# EAGLE design slouchpad_v1_shoulder (EAGLE 8.0.1)
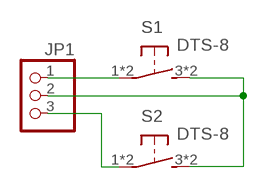
[diagram p0: schematic, sheet 1]

## Parts
JP1  PINHD-1X3  [1X03]
S1  DTS-8  [DTS-8]
S2  DTS-8  [DTS-8]

## Nets
GND: JP1.2 S1.3 S1.4 S2.3 S2.4
S1: JP1.1 S1.1 S1.2
S2: JP1.3 S2.1 S2.2

## Library data of the parts
JP1 = pinhead:PINHD-1X3: PIN HEADER
S1 S2 = switch-tact:DTS-8

## Board
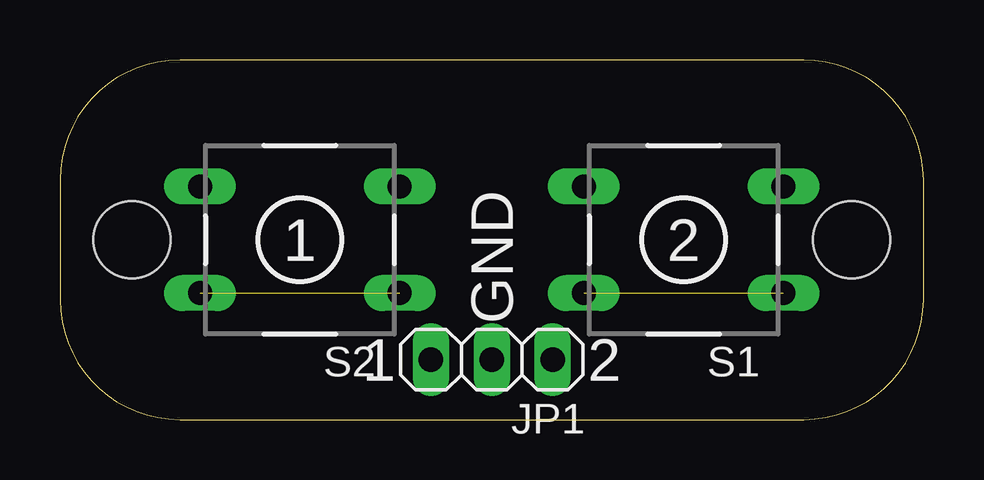
[diagram p1: board, top side]
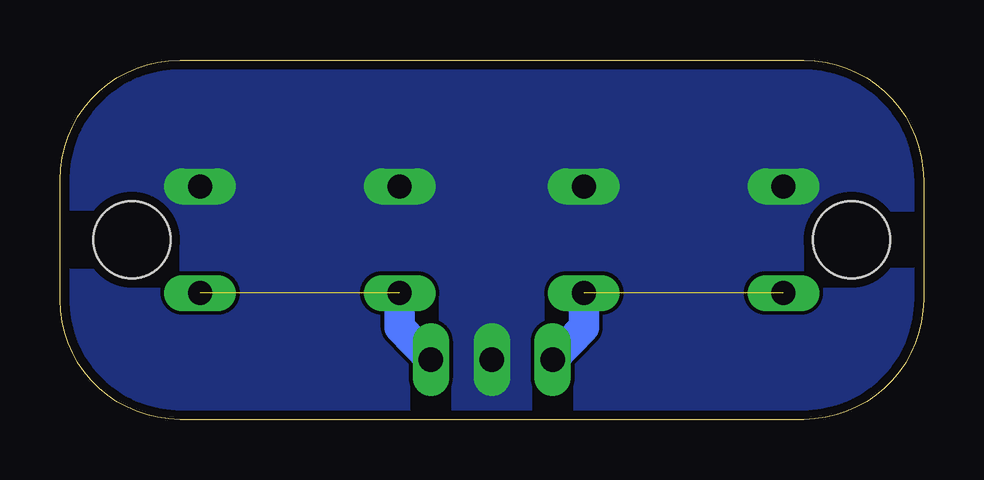
[diagram p2: board, bottom side, seen from below]

Size 36 x 15 mm. Coordinates in mm from the lower left corner, seen from the top.
Outline: 0,10 0,5 arc90 5,0 31,0 arc90 36,5 36,10 arc90 31,15 5,15 arc90 0,10
Copper layers (1*16): Top 0.0356mm / dielectric 1.5011mm / Bottom 0.0356mm
Design rules "oshpark-2layer": minimum track width 6mil, minimum drill 13mil, track to track 6mil, track to pad 6mil, pad to pad 6mil, via to via 6mil, smd to smd 6mil, copper to edge 15mil, drill to drill 6mil, minimum pad ring 7mil, minimum via ring 7mil, stop-mask expansion 2.5mil, vias tented up to drill 0mil, thermal gap 10mil
Holes 3.2 mm at 3,7.5 33,7.5

### Footprints (pad centres in the part's own frame; a part is rotated, then mirrored left to right if it is on the bottom)
1X03 = drill 1.016 long: 1 -2.54,0; 2 0,0; 3 2.54,0
DTS-8 = drill 1 long: 1 -4.159,2.223; 2 4.159,2.223; 3 -4.159,-2.223; 4 4.159,-2.223

### Placement (x,y rotation side)
JP1  18,2.5 180 top
S1  26,7.5 180 top
S2  10,7.5 180 top

### Tracks (layer width: path | path; a pad name or v marks a point on that pad's centre or on a via)
GND
  pour Bottom (no thermals): 31,0 5,0 arc-90 0,5 0,10 arc-90 5,15 31,15 arc-90 36,10 36,5 arc-90
S1  (1 unrouted)
  Bottom 1.27: JP1.1 21.84,3.84 S1.2
S2  (1 unrouted)
  Bottom 1.27: JP1.3 14.16,3.84 S2.1

### Text on the board
tSilk: 1 | 2 | GND | 1 | 2